# EAGLE schematic ASD2511 (EAGLE 6.3)
DATABASE: ./../../../../../Components/TinyCircuits_Part_Database.txt
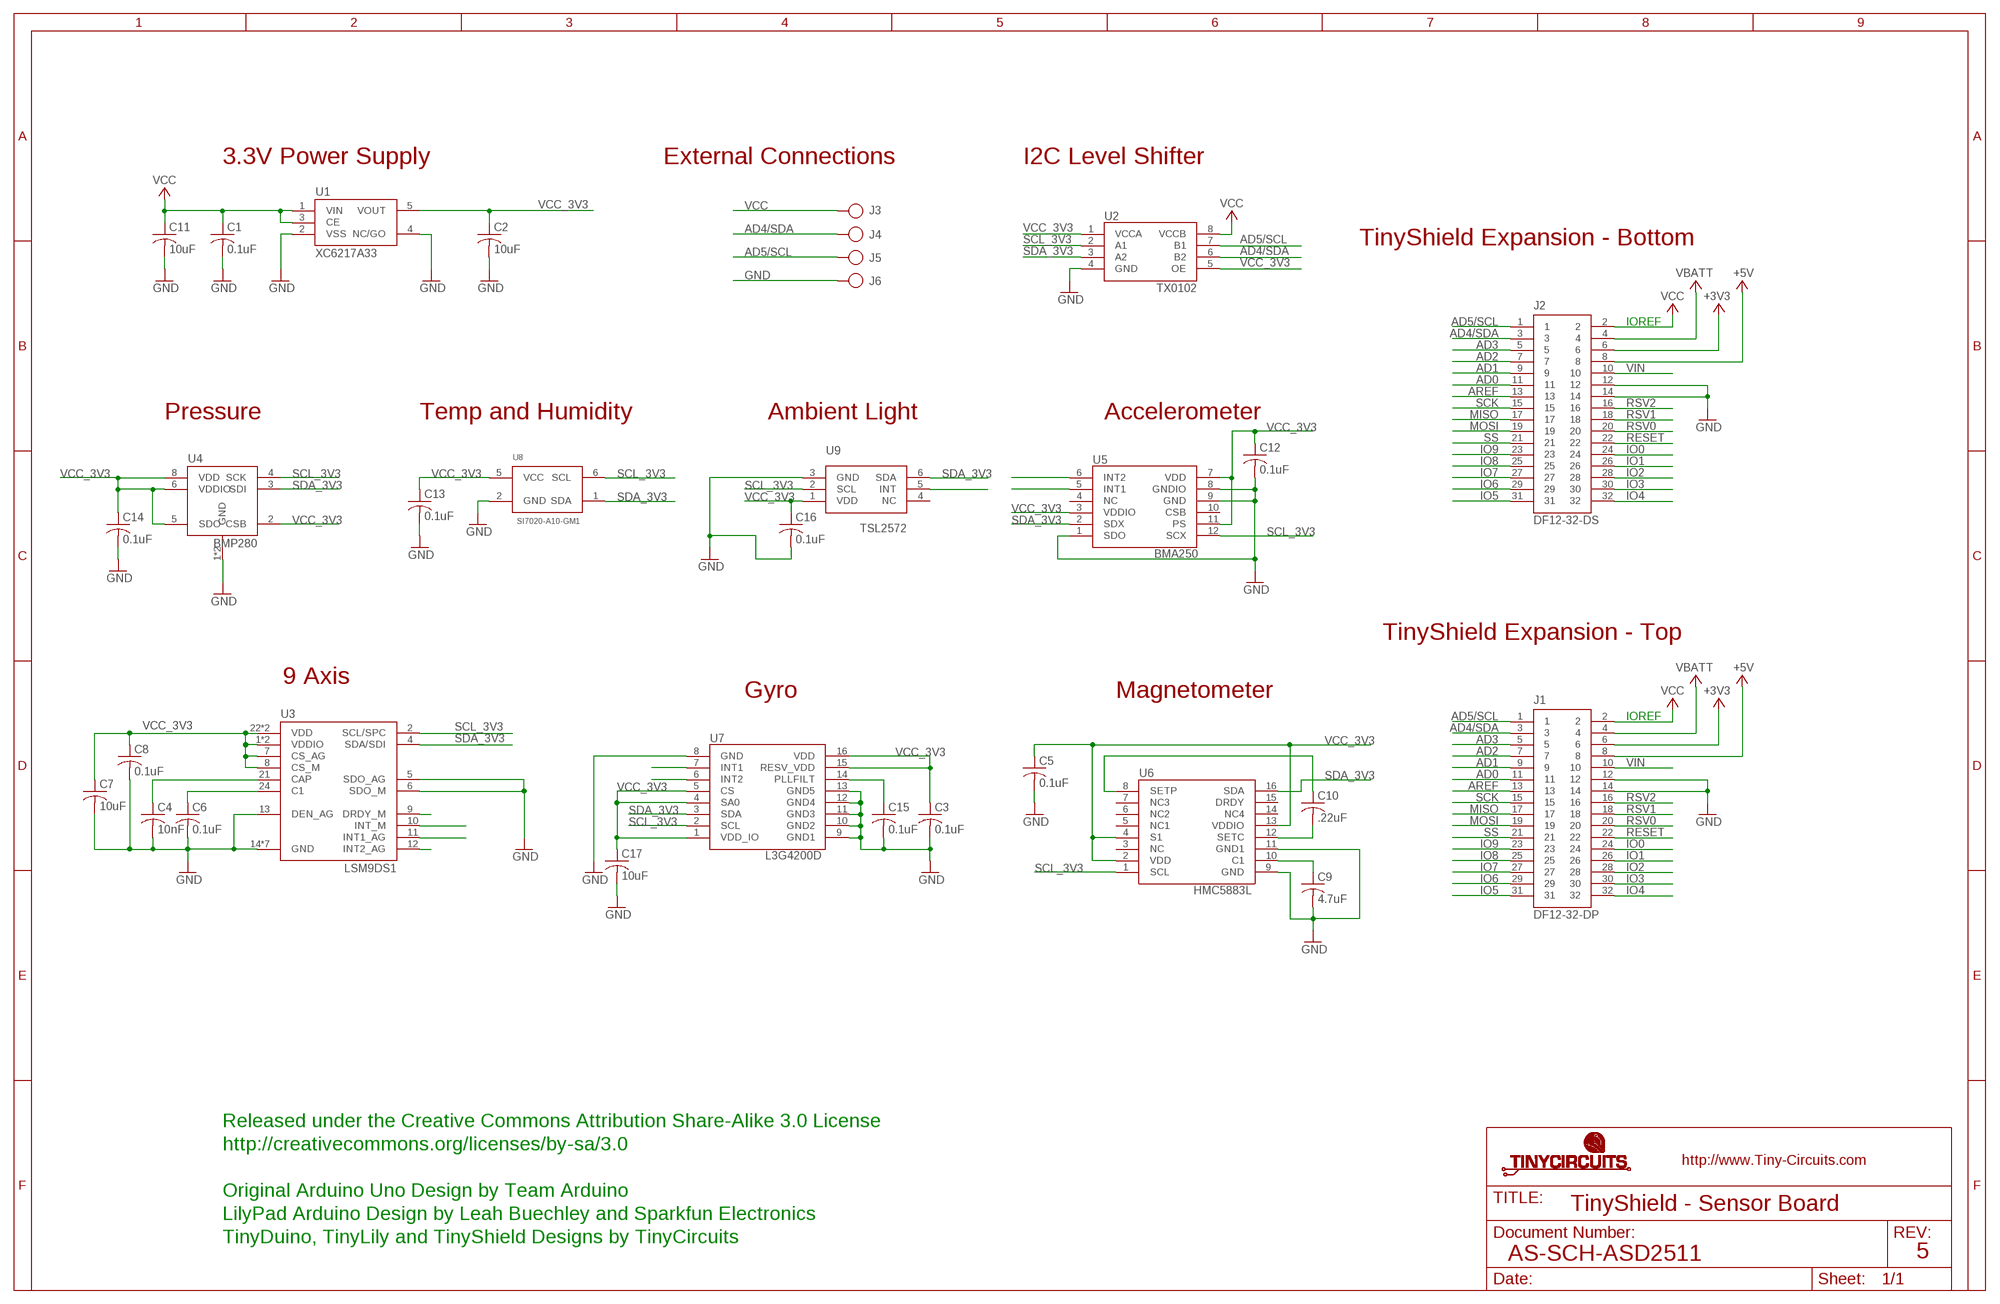
[diagram p0: schematic, sheet 1]

## Parts
C1  0.1uF  AS-ITM-00008  [C0402]
C2  10uF  AS-ITM-00002  [C0603]
C3  0.1uF  AS-ITM-00008  [C0402]
C4  10nF  AS-ITM-00084  [C0402]
C5  0.1uF  AS-ITM-00008  [C0402]
C6  0.1uF  AS-ITM-00008  [C0402]
C7  10uF  AS-ITM-00002  [C0603]
C8  0.1uF  AS-ITM-00008  [C0402]
C9  4.7uF  AS-ITM-00242  [C0402]
C10  .22uF  AS-ITM-00087  [C0402]
C11  10uF  AS-ITM-00002  [C0603]
C12  0.1uF  AS-ITM-00008  [C0402]
C13  0.1uF  AS-ITM-00008  [C0402]
C14  0.1uF  AS-ITM-00008  [C0402]
C15  0.1uF  AS-ITM-00008  [C0402]
C16  0.1uF  AS-ITM-00008  [C0402]
C17  10uF  AS-ITM-00002  [C0603]
J1  DF12-32-DP  AS-ITM-00015  [DF12-32-DP]
J2  DF12-32-DS  AS-ITM-00012  [DF12-32-DS]
J3  PIN_1X.1"1  [1X.1"_2]
J4  PIN_1X.1"1  [1X.1"_2]
J5  PIN_1X.1"1  [1X.1"_2]
J6  PIN_1X.1"1  [1X.1"_2]
U1  XC6217A33  AS-ITM-00249  [SOT-25]
U2  TX0102  AS-ITM-00073  [DQE(R-PX2SON-N8)]
U3  LSM9DS1  AS-ITM-00265  [LGA-24]
U4  BMP280  AS-ITM-00264  [BMP280]
U5  BMA250  AS-ITM-00070  [3-AXIS_ACCELEROMETER]
U6  HMC5883L  AS-ITM-00086  [HMC5883L]
U7  L3G4200D  AS-ITM-00089  [L3G4200D]
U8  SI7020-A10-GM1  AS-ITM-00218  [DFN6]
U9  TSL2572  AS-ITM-00116  [TSL2572]

## Nets
+3V3: J1.6 J2.6
+5V: J1.8 J2.8
AD0: J1.11 J2.11
AD1: J1.9 J2.9
AD2: J1.7 J2.7
AD3: J1.5 J2.5
AD4/SDA: J1.3 J2.3 J4.1 U2.6(B2)
AD5/SCL: J1.1 J2.1 J5.1 U2.7(B1)
AREF: J1.13 J2.13
GND: C1.2 C2.2 C3.2 C4.2 C5.2 C6.2 C7.2 C8.2 C9.2 C11.2 C12.2 C13.2 C14.2 C15.2 C16.2 C17.2 J1.12 J1.14 J2.12 J2.14 J6.1 U1.2(VSS) U1.4(NC/GO) U2.4(GND) U3.5(SDO_AG) U3.6(SDO_M) U3.13(DEN_AG) U3.14(GND) U3.15(GND) U3.16(GND) U3.17(GND) U3.18(GND) U3.19(GND) U3.20(GND) U4.1(GND) U4.7(GND) U5.1(SDO) U5.8(GNDIO) U5.9(GND) U6.9(GND) U6.11(GND1) U7.8(GND) U7.9(GND1) U7.10(GND2) U7.11(GND3) U7.12(GND4) U7.13(GND5) U8.2(GND) U9.3(GND)
IO0: J1.24 J2.24
IO1: J1.26 J2.26
IO2: J1.28 J2.28
IO3: J1.30 J2.30
IO4: J1.32 J2.32
IO5: J1.31 J2.31
IO6: J1.29 J2.29
IO7: J1.27 J2.27
IO8: J1.25 J2.25
IO9: J1.23 J2.23
MISO: J1.17 J2.17
MOSI: J1.19 J2.19
N$2: C4.1 U3.21(CAP)
N$3: C15.1 U7.14(PLLFILT)
N$4: C9.1 U6.10(C1)
N$6: C6.1 U3.24(C1)
N$7: C10.2 U6.12(SETC)
N$9: C10.1 U6.8(SETP)
N$10: U9.5(INT)
N$11: U3.9(DRDY_M)
N$12: U7.6(INT2)
N$14: U5.5(INT1)
N$15: U5.6(INT2)
N$16: U7.7(INT1)
N$17: U3.10(INT_M)
N$18: U3.11(INT1_AG)
N$19: U3.12(INT2_AG)
RESET: J1.22 J2.22
RSV0: J1.20 J2.20
RSV1: J1.18 J2.18
RSV2: J1.16 J2.16
SCK: J1.15 J2.15
SCL_3V3: U2.2(A1) U3.2(SCL/SPC) U4.4(SCK) U5.12(SCX) U6.1(SCL) U7.2(SCL) U8.6(SCL) U9.2(SCL)
SDA_3V3: U2.3(A2) U3.4(SDA/SDI) U4.3(SDI) U5.2(SDX) U6.16(SDA) U7.3(SDA) U8.1(SDA) U9.6(SDA)
SS: J1.21 J2.21
VBATT: J1.4 J2.4
VCC: C1.1 C11.1 J1.2 J2.2 J3.1 U1.1(VIN) U1.3(CE) U2.8(VCCB)
VCC_3V3: C2.1 C3.1 C5.1 C7.1 C8.1 C12.1 C13.1 C14.1 C16.1 C17.1 U1.5(VOUT) U2.1(VCCA) U2.5(OE) U3.1(VDDIO) U3.3(VDDIO) U3.7(CS_AG) U3.8(CS_M) U3.22(VDD) U3.23(VDD) U4.2(CSB) U4.5(SDO) U4.6(VDDIO) U4.8(VDD) U5.3(VDDIO) U5.7(VDD) U5.11(PS) U6.2(VDD) U6.4(S1) U6.13(VDDIO) U7.1(VDD_IO) U7.4(SA0) U7.5(CS) U7.15(RESV_VDD) U7.16(VDD) U8.5(VCC) U9.1(VDD)
VIN: J1.10 J2.10
Unconnected: U5.4(NC) U5.10(CSB) U6.3(NC) U6.5(NC1) U6.6(NC2) U6.7(NC3) U6.14(NC4) U6.15(DRDY) U9.4(NC)

## Notes on the sheet
- 3.3V Power Supply | External Connections | I2C Level Shifter
- TinyShield Expansion - Bottom
- IOREF
- Pressure | Temp and Humidity | Ambient Light | Accelerometer
- TinyShield Expansion - Top
- 9 Axis
- Gyro | Magnetometer
- IOREF
- Released under the Creative Commons Attribution Share-Alike 3.0 License
- http://creativecommons.org/licenses/by-sa/3.0
- Original Arduino Uno Design by Team Arduino
- TinyShield - Sensor Board
- LilyPad Arduino Design by Leah Buechley and Sparkfun Electronics
- TinyDuino, TinyLily and TinyShield Designs by TinyCircuits
- AS-SCH-ASD2511 | 5

## Library data of the parts
C1 C3 C5 C6 C8 C12-C16 = tinycircuits:AS-ITM-00008: CAP CER 0.1UF 16V 10% X5R 0402; PARTNO: AS-ITM-00008
C2 C7 C11 C17 = tinycircuits:AS-ITM-00002: CAP CER 10UF 10V 20% X5R 0603; PARTNO: AS-ITM-00002
C4 = tinycircuits:AS-ITM-00084: CAP CER 10NF 25V 10% X7R 0402; PARTNO: AS-ITM-00084
C9 = tinycircuits:AS-ITM-00242: CAP CER 4.7UF 6.3V 20% X5R 0402; PARTNO: AS-ITM-00242
C10 = tinycircuits:AS-ITM-00087: CAP CER 0.22UF 10V 10% X5R 0402; PARTNO: AS-ITM-00087
J1 = tinycircuits:AS-ITM-00015: CONN HEADER 32POS 3MM SMD 0.5MM; PARTNO: AS-ITM-00015
J2 = tinycircuits:AS-ITM-00012: CONN RECEPT 32POS 3MM SMD 0.5MM; PARTNO: AS-ITM-00012
J3-J6 = tinycircuits:PIN_1X.1": 1 Pin 0.100" Header
U1 = tinycircuits:AS-ITM-00249: IC REG LDO 3.3V 0.2A SOT25; PARTNO: AS-ITM-00249
U2 = tinycircuits:AS-ITM-00073: TI 2-Bit Bidirectional Voltage-Level Translator; PARTNO: AS-ITM-00073; VALUE: TXS0102
U3 = tinycircuits:AS-ITM-00265: 9 AXIS ACCEL GYRO MAG 3D INEMO 24TFLGA; PARTNO: AS-ITM-00265
U4 = tinycircuits:AS-ITM-00264: Board Mount Pressure Sensors Digital Barometer 2.7uA, 300-1200hPa; PARTNO: AS-ITM-00264
U5 = tinycircuits:AS-ITM-00070: 3-AXIS ACCELEROMOETER; PARTNO: AS-ITM-00070
U6 = tinycircuits:AS-ITM-00086: 3-axis digital magnetometer designed for low-field magnetic sensing; PARTNO: AS-ITM-00086
U7 = tinycircuits:AS-ITM-00089: Gyroscopes Mems Sensor 3-Axis 2.4 to 3.6 V Gyro; PARTNO: AS-ITM-00089
U8 = tinycircuits:AS-ITM-00218: IC HUMIDITY TEMPERATURE I2C DFN-6; PARTNO: AS-ITM-00218
U9 = tinycircuits:AS-ITM-00116: Light-To-Digital Converter, TSL2572; PARTNO: AS-ITM-00116